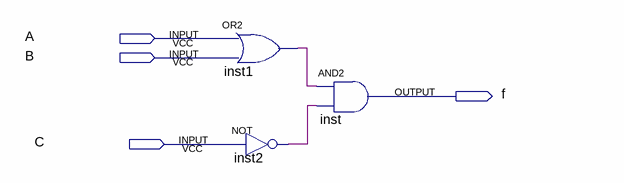
[diagram p0: schematic sheet]
// Quartus schematic lab2step1.bdf as structural Verilog: 3 symbols, 4 pins
module lab2step1 (
  input  A,
  input  B,
  input  C,
  output f
);

  wire inst1_out, inst2_out;

  or inst1 (inst1_out, A, B);
  not inst2 (inst2_out, C);
  and inst (f, inst1_out, inst2_out);
endmodule
